# Altium project 10 Channel LEDs.PrjPcb
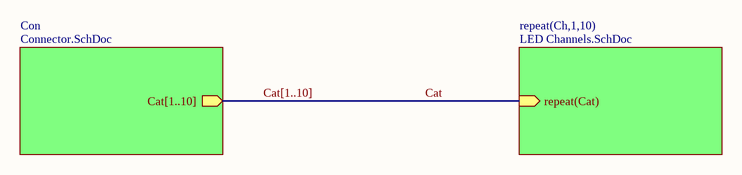
[diagram p0: Top Sheet.SchDoc]
3 sheets, 21 parts. Net scope: hierarchical (ports join the sheet entries above them; power ports are global).
Board file: PCB_10 Channel LEDs.PcbDoc
Sheets:
  Top Sheet.SchDoc
    Con = Connector.SchDoc
    Ch1 = LED Channels.SchDoc
    Ch2 = LED Channels.SchDoc
    Ch3 = LED Channels.SchDoc
    Ch4 = LED Channels.SchDoc
    Ch5 = LED Channels.SchDoc
    Ch6 = LED Channels.SchDoc
    Ch7 = LED Channels.SchDoc
    Ch8 = LED Channels.SchDoc
    Ch9 = LED Channels.SchDoc
    Ch10 = LED Channels.SchDoc

## Sheet Top Sheet.SchDoc: fddsa
size A4; DrawnBy: adsfaf; Engineer: afaffaf; Organization: sff; DocumentNumber: 1; Revision: 0; SheetNumber: 1; SheetTotal: 4; DocumentName: sfsfssf; ProjectName: sfsf

### Sub-sheets
Con = Connector.SchDoc: Cat[1..10] (out)
repeat(Ch,1,10) = LED Channels.SchDoc: repeat(Cat) (in)

### Nets
Cat: sheet repeat(Ch,1,10)/repeat(Cat)

### Buses and harness runs
bus Cat[1..10] = sheet Con/Cat[1..10]

## Sheet Connector.SchDoc: fhlkil
size A4; DrawnBy: dfdfdfdf; DocumentNumber: fdfdd; Revision: 0; SheetNumber: 1; SheetTotal: 12; DocumentName: fdfdfd; ProjectName: fddfdfd
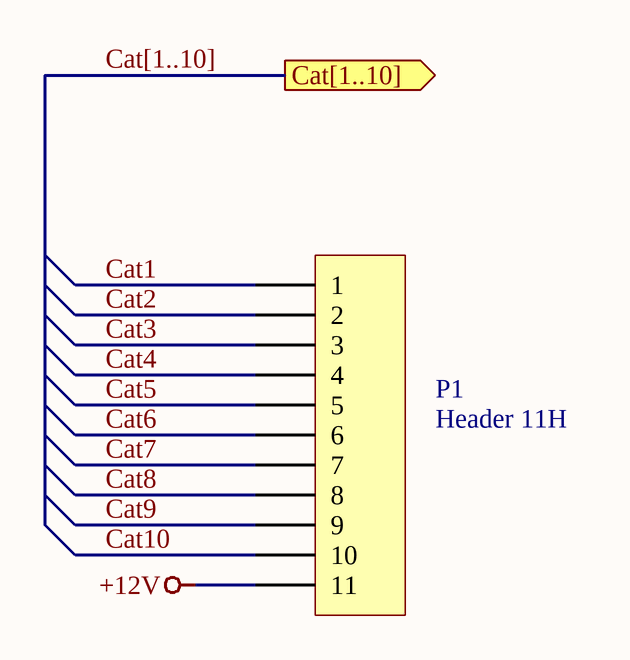
[diagram p1: Connector.SchDoc]

### Parts
P1  Header 11H  [HDR1X11H]

### Ports
Cat[1..10] (out)

### Nets
+12V: P1.11
Cat1: P1.1
Cat2: P1.2
Cat3: P1.3
Cat4: P1.4
Cat5: P1.5
Cat6: P1.6
Cat7: P1.7
Cat8: P1.8
Cat9: P1.9
Cat10: P1.10

### Buses and harness runs
bus Cat[1..10] = port Cat[1..10]

### Library data of the parts
P1 = Header 11H: Header, 11-Pin, Right Angle; LatestRevisionDate: 17-Jul-2002; LatestRevisionNote: Re-released for DXP Platform.; Publisher: Altium Limited

## Sheet LED Channels.SchDoc
size A4; Revision: 0; SheetNumber: 2; SheetTotal: 12; ProjectName: Repeated Channels
Used 10 times, as channels Ch1, Ch2, Ch3, Ch4, Ch5, Ch6, Ch7, Ch8, Ch9, Ch10. Parts and nets are listed once, with the designators drawn on the sheet.
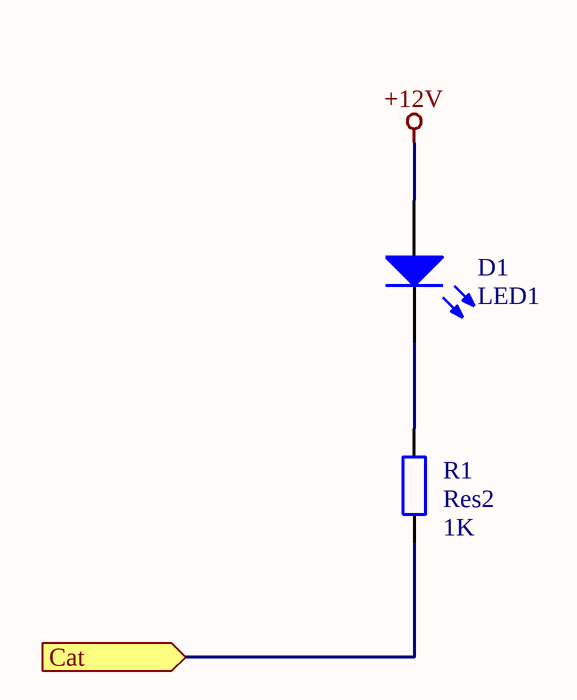
[diagram p2: LED Channels.SchDoc]

### Parts
D1  LED1  [LED-1]
R1  Res2  value 1K  [AXIAL-0.4]

### Ports
Cat (in)

### Nets
+12V: D1.1(A)
Cat: R1.1 ; port Cat
NetD1_2: D1.2(K) R1.2

### Channels
Ch1: designators end in _1; ports Cat=Cat1
Ch2: designators end in _2; ports Cat=Cat2
Ch3: designators end in _3; ports Cat=Cat3
Ch4: designators end in _4; ports Cat=Cat4
Ch5: designators end in _5; ports Cat=Cat5
Ch6: designators end in _6; ports Cat=Cat6
Ch7: designators end in _7; ports Cat=Cat7
Ch8: designators end in _8; ports Cat=Cat8
Ch9: designators end in _9; ports Cat=Cat9
Ch10: designators end in _10; ports Cat=Cat10

### Library data of the parts
D1 = LED1: Typical RED GaAs LED; Published: 8-Jun-2000; LatestRevisionDate: 08-Jul-2005; LatestRevisionNote: Mech Layer 1 removed.; PackageReference: LED-1; Publisher: Altium Limited; PackageDescription: LED; 2 Leads
R1 = Res2: Resistor; Published: 8-Jun-2000; LatestRevisionDate: 17-Jul-2002; LatestRevisionNote: Re-released for DXP Platform.; PackageReference: AXIAL-0.4; Publisher: Altium Limited; PackageDescription: Axial Device, Thru-Hole; 2 Leads; 0.4 in Pin Spacing

## Nets that join several sheets
+12V: Connector (P1.11), Ch1 (D1_1.1), Ch2 (D1_2.1), Ch3 (D1_3.1), Ch4 (D1_4.1), Ch5 (D1_5.1), Ch6 (D1_6.1), Ch7 (D1_7.1), Ch8 (D1_8.1), Ch9 (D1_9.1), Ch10 (D1_10.1)
Cat1: Connector (P1.1), Ch1 (R1_1.1)
Cat2: Connector (P1.2), Ch2 (R1_2.1)
Cat3: Connector (P1.3), Ch3 (R1_3.1)
Cat4: Connector (P1.4), Ch4 (R1_4.1)
Cat5: Connector (P1.5), Ch5 (R1_5.1)
Cat6: Connector (P1.6), Ch6 (R1_6.1)
Cat7: Connector (P1.7), Ch7 (R1_7.1)
Cat8: Connector (P1.8), Ch8 (R1_8.1)
Cat9: Connector (P1.9), Ch9 (R1_9.1)
Cat10: Connector (P1.10), Ch10 (R1_10.1)